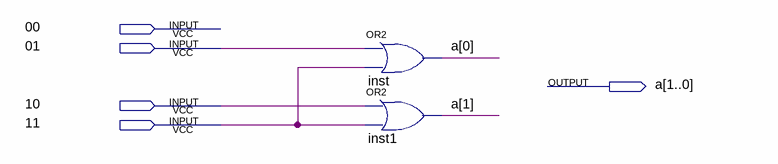
[diagram p0: schematic sheet]
// Quartus schematic cod42.bdf as structural Verilog: 2 symbols, 5 pins
module cod42 (
  input  \00 ,
  input  \01 ,
  input  \10 ,
  input  \11 ,
  output [1:0] a
);

  or inst (a[0], \01 , \11 );
  or inst1 (a[1], \10 , \11 );
endmodule
